# EAGLE design PowerStage (EAGLE 6.4)
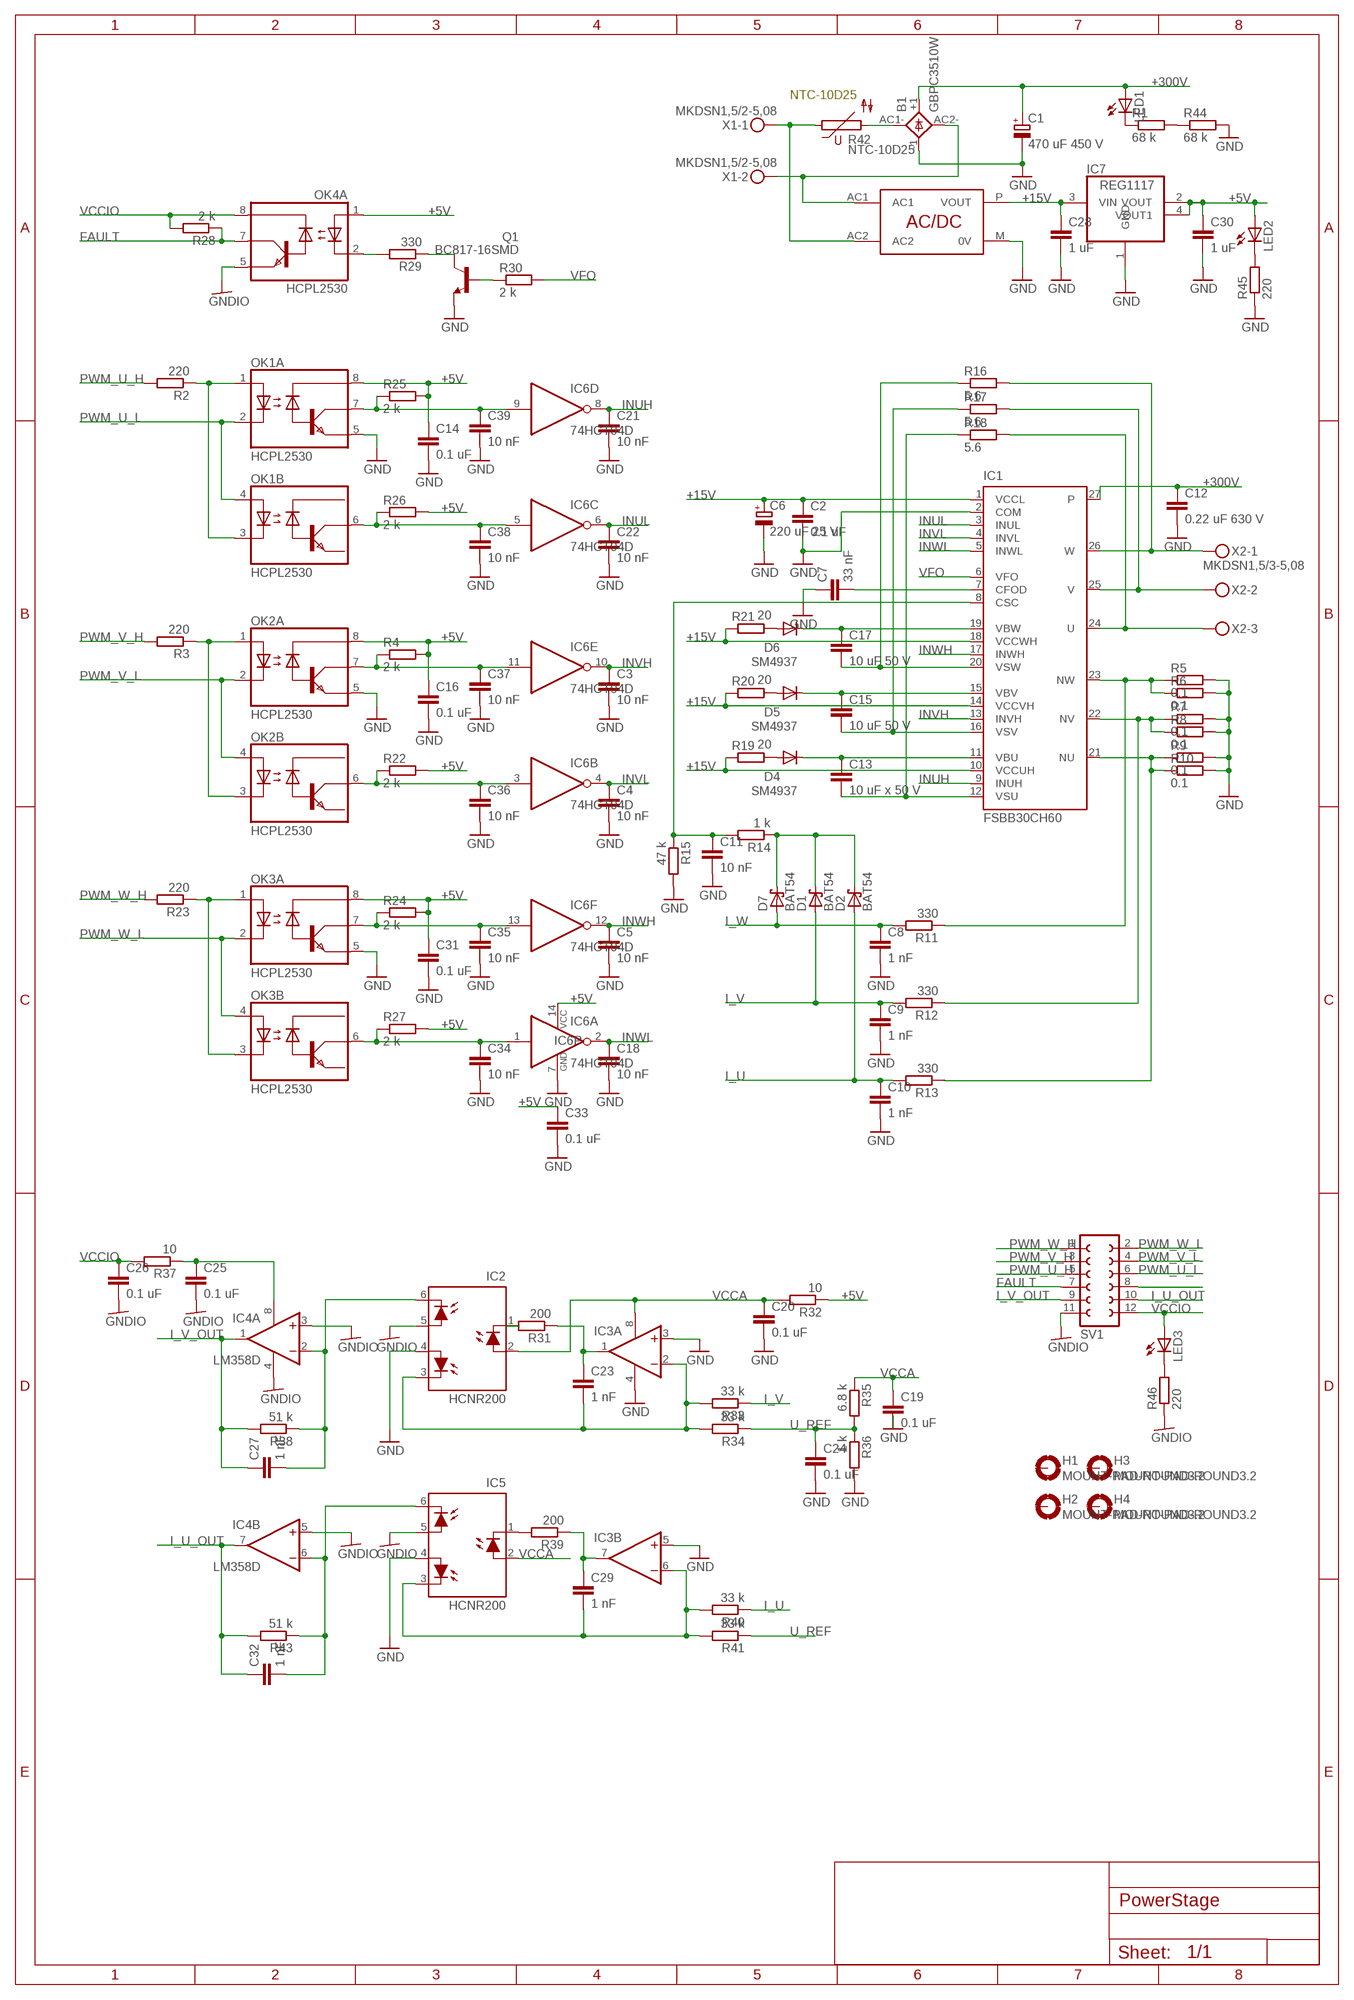
[diagram p0: schematic, sheet 1]

## Parts
B1  GBPC3510W  GBPC-W  [GBPC-W]
C1  470 uF 450 V  CPOL-EUE10-35  [EB35D]
C2  0.1 uF  C-EUC0603  [C0603]
C3  10 nF  C-EUC0603  [C0603]
C4  10 nF  C-EUC0603  [C0603]
C5  10 nF  C-EUC0603  [C0603]
C6  220 uF 25 V  CPOL-EUG  [PANASONIC_G]
C7  33 nF  C-EUC0603  [C0603]
C8  1 nF  C-EUC0603  [C0603]
C9  1 nF  C-EUC0603  [C0603]
C10  1 nF  C-EUC0603  [C0603]
C11  10 nF  C-EUC0603  [C0603]
C12  0.22 uF 630 V  C-EU150-091X182  [C150-091X182]
C13  10 uF x 50 V  C-EUC1210  [C1210]
C14  0.1 uF  C-EUC0603  [C0603]
C15  10 uF 50 V  C-EUC1210  [C1210]
C16  0.1 uF  C-EUC0603  [C0603]
C17  10 uF 50 V  C-EUC1210  [C1210]
C18  10 nF  C-EUC0603  [C0603]
C19  0.1 uF  C-EUC0603  [C0603]
C20  0.1 uF  C-EUC0603  [C0603]
C21  10 nF  C-EUC0603  [C0603]
C22  10 nF  C-EUC0603  [C0603]
C23  1 nF  C-EUC0603  [C0603]
C24  0.1 uF  C-EUC0603  [C0603]
C25  0.1 uF  C-EUC0603  [C0603]
C26  0.1 uF  C-EUC0603  [C0603]
C27  1 nF  C-EUC0603  [C0603]
C28  1 uF  C-EUC0603  [C0603]
C29  1 nF  C-EUC0603  [C0603]
C30  1 uF  C-EUC0603  [C0603]
C31  0.1 uF  C-EUC0603  [C0603]
C32  1 nF  C-EUC0603  [C0603]
C33  0.1 uF  C-EUC0603  [C0603]
C34  10 nF  C-EUC0603  [C0603]
C35  10 nF  C-EUC0603  [C0603]
C36  10 nF  C-EUC0603  [C0603]
C37  10 nF  C-EUC0603  [C0603]
C38  10 nF  C-EUC0603  [C0603]
C39  10 nF  C-EUC0603  [C0603]
D1  BAT54  [SOT23]
D2  BAT54  [SOT23]
D4  SM4937  DIODE-MELF-MLL41  [MELF-MLL41]
D5  SM4937  DIODE-MELF-MLL41  [MELF-MLL41]
D6  SM4937  DIODE-MELF-MLL41  [MELF-MLL41]
D7  BAT54  [SOT23]
H1  MOUNT-PAD-ROUND3.2  [3,2-PAD]
H2  MOUNT-PAD-ROUND3.2  [3,2-PAD]
H3  MOUNT-PAD-ROUND3.2  [3,2-PAD]
H4  MOUNT-PAD-ROUND3.2  [3,2-PAD]
IC1  FSBB30CH60  [FSBB30CH60]
IC2  HCNR200  [DIL08-400]
IC3  2AMP_P8+4D  [SO08]
IC4  LM358D  [SO08]
IC5  HCNR200  [DIL08-400]
IC6  74HCT04D  [SO14]
IC7  REG1117  [SOT223]
LED1  LEDCHIP-LED0603  [CHIP-LED0603]
LED2  LEDCHIP-LED0603  [CHIP-LED0603]
LED3  LEDCHIP-LED0603  [CHIP-LED0603]
OK1  HCPL2530  [DIL08]
OK2  HCPL2530  [DIL08]
OK3  HCPL2530  [DIL08]
OK4  HCPL2530  [DIL08]
Q1  BC817-16SMD  [SOT23-BEC]
R1  68 k  R-EU_R1206  [R1206]
R2  220  R-EU_R0603  [R0603]
R3  220  R-EU_R0603  [R0603]
R4  2 k  R-EU_R0603  [R0603]
R5  0.1  R-EU_R2512  [R2512]
R6  0.1  R-EU_R2512  [R2512]
R7  0.1  R-EU_R2512  [R2512]
R8  0.1  R-EU_R2512  [R2512]
R9  0.1  R-EU_R2512  [R2512]
R10  0.1  R-EU_R2512  [R2512]
R11  330  R-EU_R0603  [R0603]
R12  330  R-EU_R0603  [R0603]
R13  330  R-EU_R0603  [R0603]
R14  1 k  R-EU_R0603  [R0603]
R15  47 k  R-EU_R0603  [R0603]
R16  5.6  R-EU_R1206  [R1206]
R17  5.6  R-EU_R1206  [R1206]
R18  5.6  R-EU_R1206  [R1206]
R19  20  R-EU_R1206  [R1206]
R20  20  R-EU_R1206  [R1206]
R21  20  R-EU_R1206  [R1206]
R22  2 k  R-EU_R0603  [R0603]
R23  220  R-EU_R0603  [R0603]
R24  2 k  R-EU_R0603  [R0603]
R25  2 k  R-EU_R0603  [R0603]
R26  2 k  R-EU_R0603  [R0603]
R27  2 k  R-EU_R0603  [R0603]
R28  2 k  R-EU_R0603  [R0603]
R29  330  R-EU_R0603  [R0603]
R30  2 k  R-EU_R0603  [R0603]
R31  200  R-EU_R0603  [R0603]
R32  10  R-EU_R0603  [R0603]
R33  33 k  R-EU_R0603  [R0603]
R34  33 k  R-EU_R0603  [R0603]
R35  6.8 k  R-EU_R0603  [R0603]
R36  1 k  R-EU_R0603  [R0603]
R37  10  R-EU_R0603  [R0603]
R38  51 k  R-EU_R0603  [R0603]
R39  200  R-EU_R0603  [R0603]
R40  33 k  R-EU_R0603  [R0603]
R41  33 k  R-EU_R0603  [R0603]
R42  NTC-10D25  S20K40  [S20K40]
R43  51 k  R-EU_R0603  [R0603]
R44  68 k  R-EU_R1206  [R1206]
R45  220  R-EU_R0603  [R0603]
R46  220  R-EU_R0603  [R0603]
SV1  FE06-2  [FE06-2]
U$1  KUUKO_090873  [KUUKO_090873]
X1  MKDSN1,5/2-5,08  [MKDSN1,5/2-5,08]
X2  MKDSN1,5/3-5,08  [MKDSN1,5/3-5,08]

## Nets
+5V: C14.1 C16.1 C30.1 C31.1 C33.1 IC6.14(P:VCC) IC7.2(VOUT) IC7.4(VOUT1) LED2.A OK1.8(A:VCC) OK2.8(A:VCC) OK3.8(A:VCC) OK4.1(A:A1) R4.2 R22.2 R24.2 R25.2 R26.2 R27.2 R32.1
+15V: C2.1 C6.+ C28.1 IC1.1(VCCL) IC1.10(VCCUH) IC1.14(VCCVH) IC1.18(VCCWH) IC7.3(VIN) R19.1 R20.1 R21.1 U$1.P(VOUT)
+300V: B1.+1(+) C1.+ C12.1 IC1.27(P) LED1.A
FAULT: OK4.7(A:VO1) R28.1 SV1.7
GND: B1.-1(-) C1.- C2.2 C3.2 C4.2 C5.2 C6.- C7.1 C8.2 C9.2 C10.2 C11.2 C12.2 C14.2 C16.2 C18.2 C19.2 C20.2 C21.2 C22.2 C24.2 C28.2 C30.2 C31.2 C33.2 C34.2 C35.2 C36.2 C37.2 C38.2 C39.2 IC1.2(COM) IC2.4(A1) IC3.3(A:+IN) IC3.4(P:V-) IC3.5(B:+IN) IC5.4(A1) IC6.7(P:GND) IC7.1(GND) OK1.5(A:GND) OK2.5(A:GND) OK3.5(A:GND) Q1.E R5.2 R6.2 R7.2 R8.2 R9.2 R10.2 R15.2 R36.2 R44.2 R45.1 U$1.M(0V)
GNDIO: C25.2 C26.2 IC2.5(A2) IC4.3(A:+IN) IC4.4(P:V-) IC4.5(B:+IN) IC5.5(A2) OK4.5(A:GND) R46.1 SV1.11
I_U: C10.1 D2.1(A) R13.2 R40.1
I_U_OUT: C32.1 IC4.7(B:OUT) R43.2 SV1.10
I_V: C9.1 D1.1(A) R12.2 R33.1
I_V_OUT: C27.1 IC4.1(A:OUT) R38.2 SV1.9
I_W: C8.1 D7.1(A) R11.2
INUH: C21.1 IC1.9(INUH) IC6.8(D:O)
INUL: C22.1 IC1.3(INUL) IC6.6(C:O)
INVH: C3.1 IC1.13(INVH) IC6.10(E:O)
INVL: C4.1 IC1.4(INVL) IC6.4(B:O)
INWH: C5.1 IC1.17(INWH) IC6.12(F:O)
INWL: C18.1 IC1.5(INWL) IC6.2(A:O)
N$1: IC1.23(NW) R5.1 R6.1 R11.1
N$2: OK1.1(A:A1) OK1.3(B:C2) R2.1
N$3: B1.AC1-(AC1) R42.2
N$5: B1.AC2-(AC2) U$1.AC1 X1.2
N$6: IC1.26(W) R16.2 X2.1
N$7: IC1.25(V) R17.2 X2.2
N$8: IC1.24(U) R18.2 X2.3
N$9: IC5.1(C) R39.2
N$10: C25.1 IC4.8(P:V+) R37.1
N$11: IC1.22(NV) R7.1 R8.1 R12.1
N$12: IC1.21(NU) R9.1 R10.1 R13.1
N$13: C7.2 IC1.7(CFOD)
N$14: D1.3(C) D2.3(C) D7.3(C) R14.1
N$15: C11.1 IC1.8(CSC) R14.2 R15.1
N$16: C13.1 D4.C IC1.11(VBU)
N$17: C13.2 IC1.12(VSU) R18.1
N$18: D4.A R19.2
N$19: C15.1 D5.C IC1.15(VBV)
N$20: C15.2 IC1.16(VSV) R17.1
N$21: D5.A R20.2
N$22: C17.1 D6.C IC1.19(VBW)
N$23: C17.2 IC1.20(VSW) R16.1
N$24: D6.A R21.2
N$25: OK4.2(A:C1) R29.2
N$26: Q1.C R29.1
N$27: Q1.B R30.1
N$28: C23.2 IC2.3(C1) IC3.2(A:-IN) R33.2 R34.2
N$29: OK2.1(A:A1) OK2.3(B:C2) R3.1
N$30: SV1.8
N$31: C27.2 IC2.6(C2) IC4.2(A:-IN) R38.1
N$32: OK3.1(A:A1) OK3.3(B:C2) R23.1
N$33: C39.1 IC6.9(D:I) OK1.7(A:VO1) R25.1
N$34: C29.2 IC3.6(B:-IN) IC5.3(C1) R40.2 R41.2
N$35: C29.1 IC3.7(B:OUT) R39.1
N$36: C23.1 IC3.1(A:OUT) R31.1
N$37: C32.2 IC4.6(B:-IN) IC5.6(C2) R43.1
N$38: IC2.1(C) R31.2
N$39: C38.1 IC6.5(C:I) OK1.6(B:VO2) R26.1
N$40: C37.1 IC6.11(E:I) OK2.7(A:VO1) R4.1
N$41: C36.1 IC6.3(B:I) OK2.6(B:VO2) R22.1
N$42: C35.1 IC6.13(F:I) OK3.7(A:VO1) R24.1
N$43: C34.1 IC6.1(A:I) OK3.6(B:VO2) R27.1
N$44: LED1.C R1.1
N$45: R1.2 R44.1
N$46: LED2.C R45.2
N$47: LED3.C R46.2
N$48: R42.1 U$1.AC2 X1.1
PWM_U_H: R2.2 SV1.5
PWM_U_L: OK1.2(A:C1) OK1.4(B:A2) SV1.6
PWM_V_H: R3.2 SV1.3
PWM_V_L: OK2.2(A:C1) OK2.4(B:A2) SV1.4
PWM_W_H: R23.2 SV1.1
PWM_W_L: OK3.2(A:C1) OK3.4(B:A2) SV1.2
U_REF: C24.1 R34.1 R35.2 R36.1 R41.1
VCCA: C19.1 C20.1 IC2.2(A) IC3.8(P:V+) IC5.2(A) R32.2 R35.1
VCCIO: C26.1 LED3.A OK4.8(A:VCC) R28.2 R37.2 SV1.12
VFO: IC1.6(VFO) R30.2
Unconnected: H1.B3,2(MOUNT) H2.B3,2(MOUNT) H3.B3,2(MOUNT) H4.B3,2(MOUNT) OK4.3(B:C2) OK4.4(B:A2) OK4.6(B:VO2)

## Notes on the sheet
- NTC-10D25

## Library data of the parts
B1 = rectifier:GBPC-W
C1 C6 = rcl:CPOL-EU: POLARIZED CAPACITOR, European symbol
C2-C5 C7-C39 = rcl:C-EU: CAPACITOR, European symbol
D1 D2 D7 = diode:BAT54: Schottky Diodes Source: Fairchild .. BAT54.pdf
D4-D6 = diode:DIODE-: DIODE
H1-H4 = holes:MOUNT-PAD-ROUND: MOUNTING PAD, round
IC1 = fairchild-semic:FSBB30CH60: Smart Power Module 600V-30A IGBT inverter for three-phase DC/AC power conversion Source: http://www.fairchildsemi.com/ds/FS/FSBB30CH60.pdf; MPN: FSBB30CH60B; OC_FARNELL: 1783234; OC_NEWARK: 78M1076
IC2 IC5 = avago:HCNR20*: High-Linearity Analog Optocouplers Source: AV02-0886EN+DS+HCNR200+10Dec2011.pdf
IC3 = linear:2AMP_P8+4: OP AMP
IC4 = linear:LM358: OP AMP also LM158; LM258; LM2904 Source: http://cache.national.com/ds/LM/LM158.pdf
IC6 = 74xx-eu:74*04: Hex INVERTER
IC7 = burr-brown:REG1117: 800mA and 1A Low Dropout (LDO) Positive Regulator 1.8V, 2.5V, 2.85V, 3.3V, 5V, and Adj; MPN: REG1117; OC_FARNELL: 1097566; OC_NEWARK: 14P6981
LED1-LED3 = led:LED: LED OSRAM: - CHIPLED LG R971, LG N971, LY N971, LG Q971, LY Q971, LO R971, LY R971 LH N974, LH R974 LS Q976, LO Q976, LY Q976 LO Q996 - Hyper CHIPLED LW Q18S LB Q993, LB Q99A, LB R99A - SideLED LS A670, LO A670, LY A670, LG A670, LP A670 LB A673, LV A673, LT A673, LW A673 LH A674 LY A675 LS A676, LA A676, LO A676, LY A676, LW A676 LS A679, LY A679, LG A679 - Hyper Micro SIDELED® LS Y876, LA Y876, LO Y876, LY Y876 LT Y87S - SmartLED LW L88C, LW L88S LB L89C, LB L89S, LG L890 LS L89K, LO L89K, LY L89K LS L896, LA L896, LO L896, LY L896 - TOPLED LS T670, LO T670, LY T670, LG T670, LP T670 LSG T670, LSP T670, LSY T670, LOP T670, LYG T670 LG T671, LOG T671, LSG T671 LB T673, LV T673, LT T673, LW T673 LH T674 LS T676, LA T676, LO T676, LY T676, LB T676, LH T676, LSB T676, LW T676 LB T67C, LV T67C, LT T67C, LS T67K, LO T67K, LY T67K, LW E67C LS E67B, LA E67B, LO E67B, LY E67B, LB E67C, LV E67C, LT E67C LW T67C LS T679, LY T679, LG T679 LS T770, LO T770, LY T770, LG T770, LP T770 LB T773, LV T773, LT T773, LW T773 LH T774 LS E675, LA E675, LY E675, LS T675 LS T776, LA T776, LO T776, LY T776, LB T776 LHGB T686 LT T68C, LB T68C - Hyper Mini TOPLED® LB M676 - Mini TOPLED Santana® LG M470 LS M47K, LO M47K, LY M47K Source: http://www.osram.convergy.de LUXEON: - LUMILED® LXK2-PW12-R00, LXK2-PW12-S00, LXK2-PW14-U00, LXK2-PW14-V00 LXK2-PM12-R00, LXK2-PM12-S00, LXK2-PM14-U00 LXK2-PE12-Q00, LXK2-PE12-R00, LXK2-PE12-S00, LXK2-PE14-T00, LXK2-PE14-U00 LXK2-PB12-K00, LXK2-PB12-L00, LXK2-PB12-M00, LXK2-PB14-N00, LXK2-PB14-P00, LXK2-PB14-Q00 LXK2-PR12-L00, LXK2-PR12-M00, LXK2-PR14-Q00, LXK2-PR14-R00 LXK2-PD12-Q00, LXK2-PD12-R00, LXK2-PD12-S00 LXK2-PH12-R00, LXK2-PH12-S00 LXK2-PL12-P00, LXK2-PL12-Q00, LXK2-PL12-R00 Source: www.luxeon.com KINGBRIGHT: KA-3528ASYC Source: www.kingbright.com
OK1-OK4 = optocoupler:HCPL2530: HEWLETT PACKARD OPTO COUPLER; MF: AGILENT TECHNOLOGIES; MPN: HCPL-2530-000E; OC_FARNELL: 9994793; OC_NEWARK: 31K6974
Q1 = transistor-npn:BC817*: NPN Transistor
R1 R44 = resistor:R-EU_: RESISTOR, European symbol
R2-R41 R43 R45 R46 = rcl:R-EU_: RESISTOR, European symbol
R42 = varistor:S20K40: VARISTOR
SV1 = con-lsta:FE06-2: FEMALE HEADER; OC_FARNELL: unknown; OC_NEWARK: unknown
U$1 = dc-dc-converter:KUUKO_090873
X1 = con-phoenix-508:MKDSN1,5/2-5,08: MKDSN 1,5/ 2-5,08 Printklemme Nennstrom: 13,5 A Nennspannung: 250 V Rastermaß: 5,08 mm Polzahl: 2 Anschlussart: Schraubanschluss Montage: Löten Anschlussrichtung Leiter/Platine: 0 ° Artikelnummer: 1729128 Source: http://eshop.phoenixcontact.com .. 1729128.pdf; MPN: MKDSN 1,5/2-5.08; OC_FARNELL: 1792903; OC_NEWARK: 30M2397
X2 = con-phoenix-508:MKDSN1,5/3-5,08: MKDSN 1,5/ 3-5,08 Printklemme Nennstrom: 13,5 A Nennspannung: 250 V Rastermaß: 5,08 mm Polzahl: 3 Anschlussart: Schraubanschluss Montage: Löten Anschlussrichtung Leiter/Platine: 0 ° Artikelnummer: 1729131 Source: http://eshop.phoenixcontact.com .. 1729131.pdf; MPN: SMKDSN1,5/3-5,08; OC_FARNELL: 1792904; OC_NEWARK: 70R0299

## Board
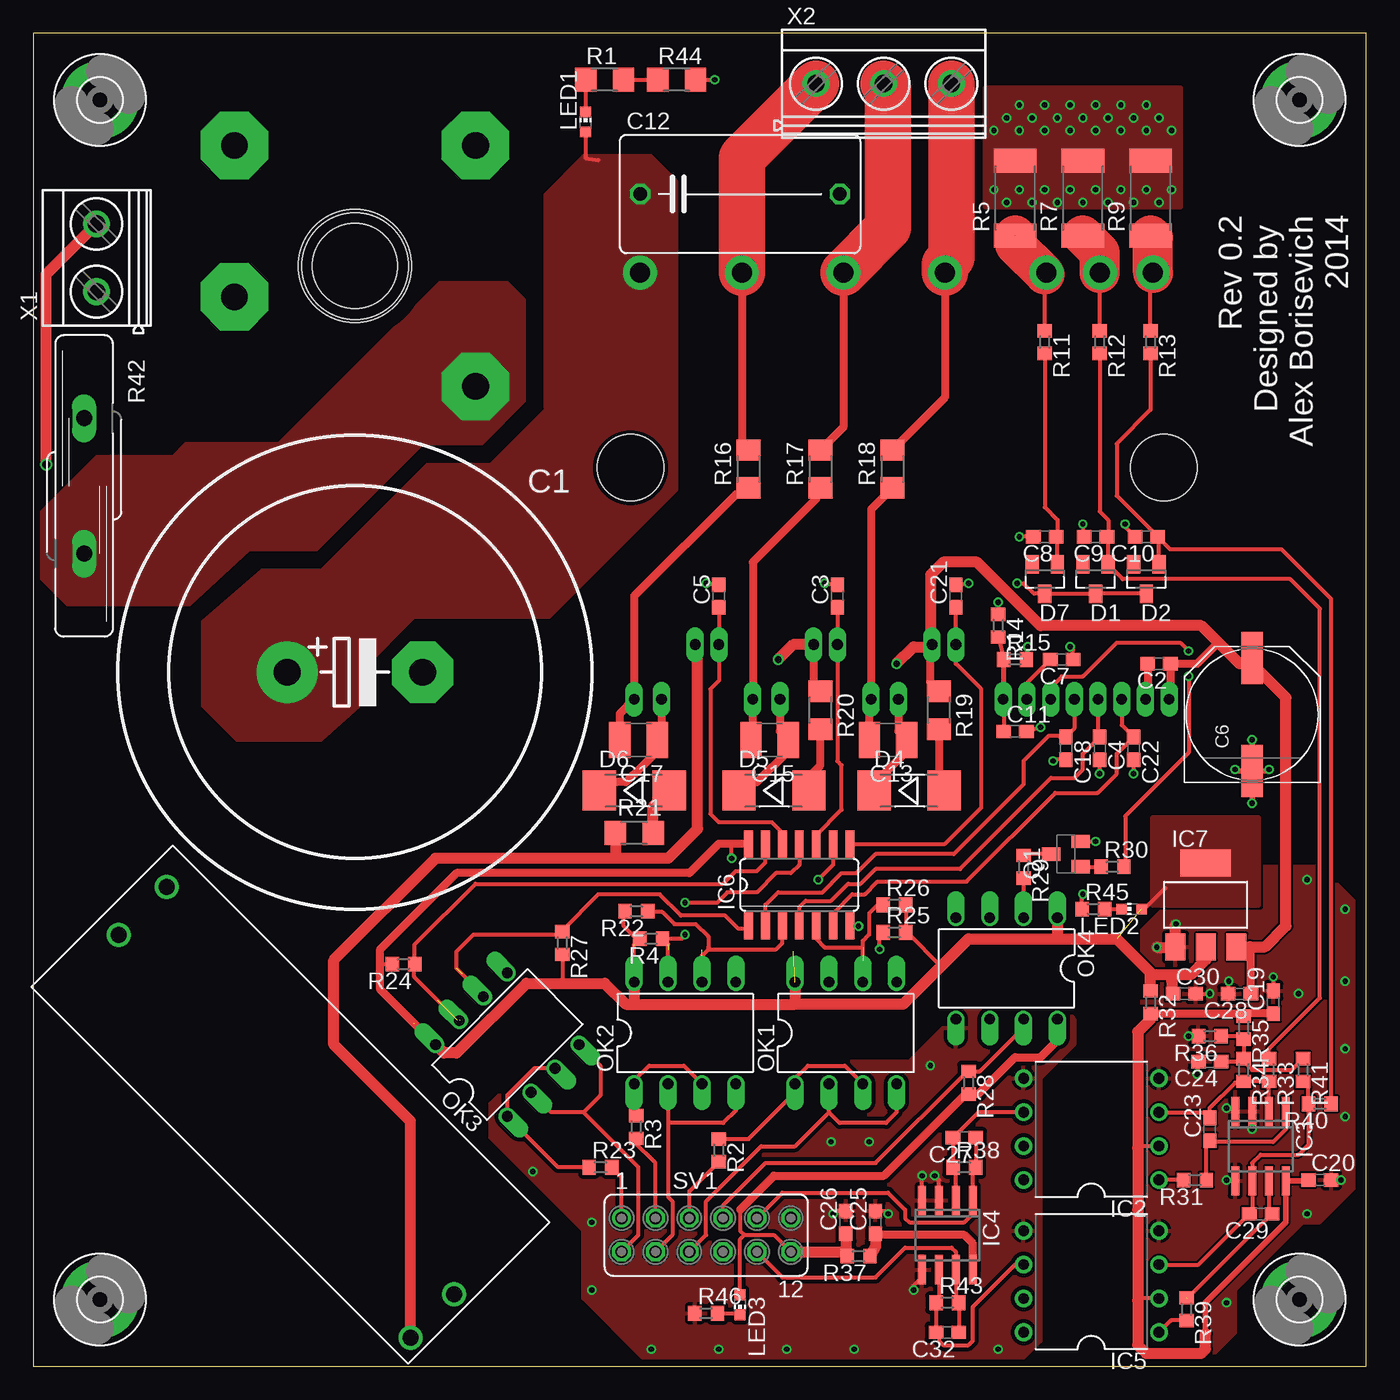
[diagram p1: board, top side]
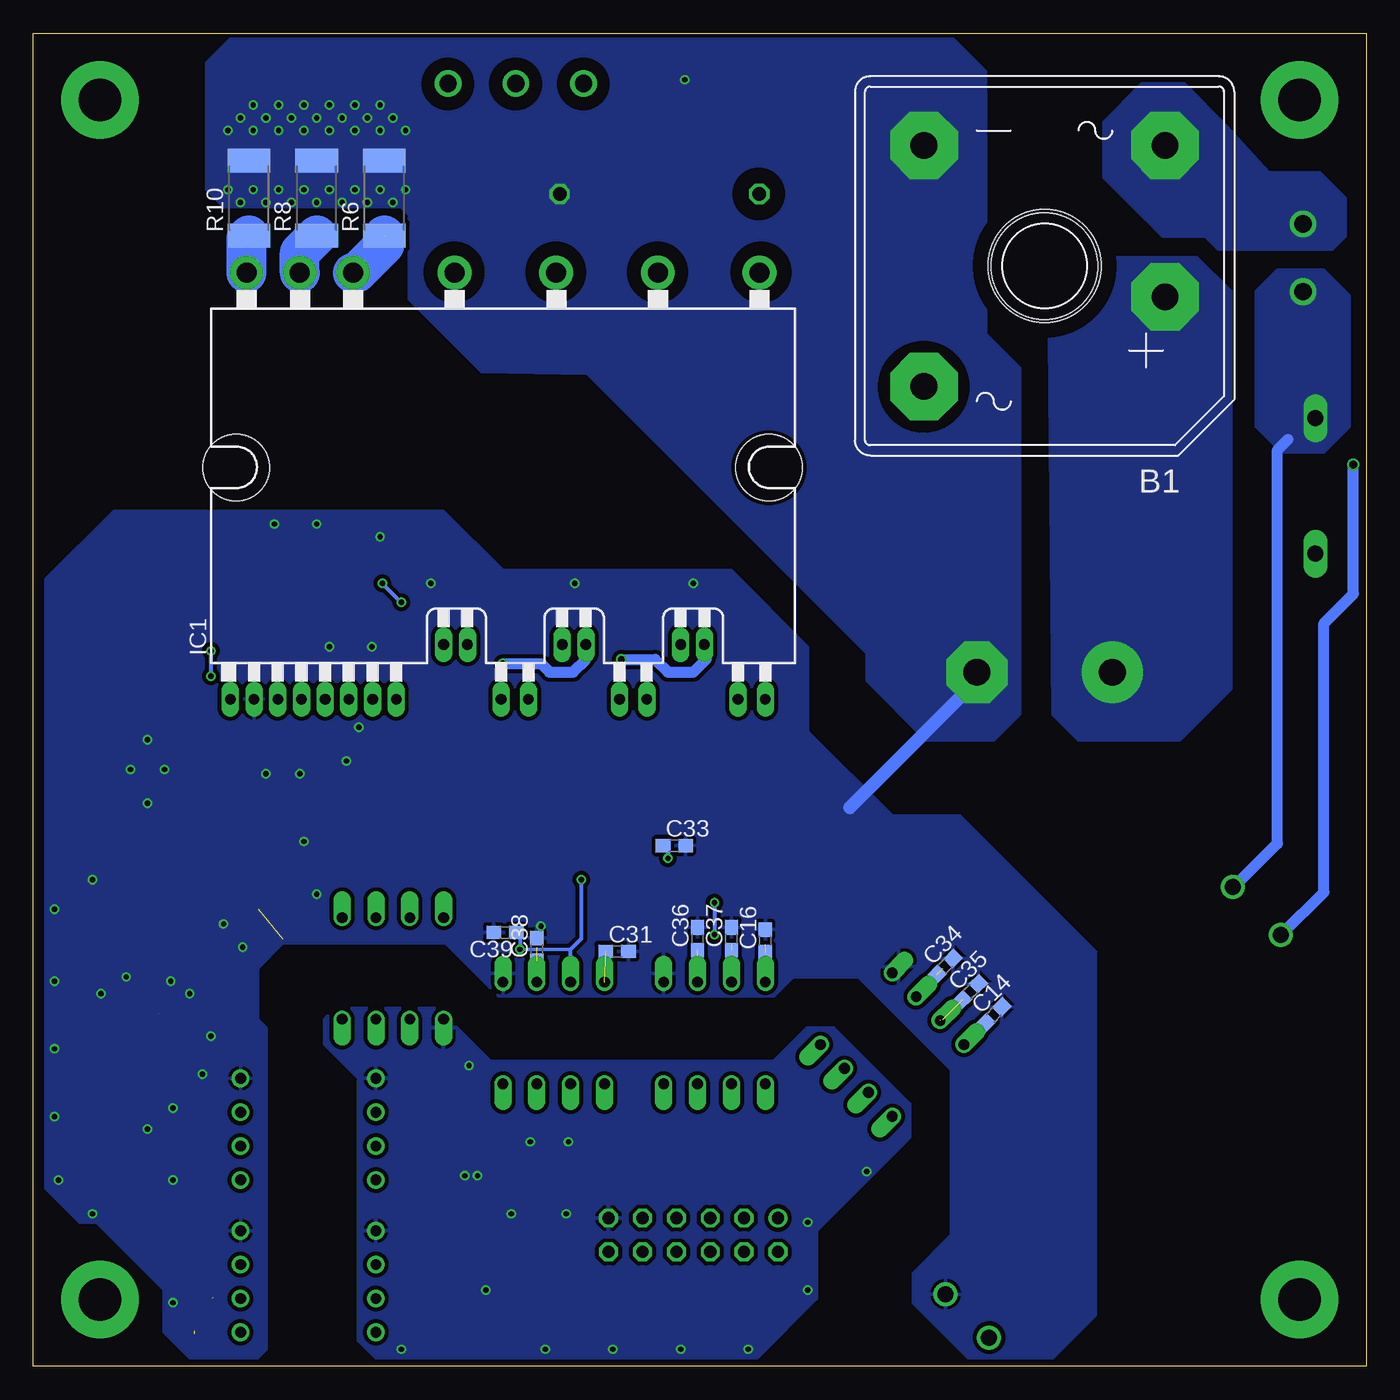
[diagram p2: board, bottom side, seen from below]

Size 100 x 100 mm. Coordinates in mm from the lower left corner, seen from the top.
Outline: 0,0 100,0 100,100 0,100 0,0
Copper layers (1*16): Top 0.035mm / dielectric 1.5mm / Bottom 0.035mm
Design rules "ITEADstudio_DRC": minimum track width 6mil, minimum drill 12mil, track to track 6mil, track to pad 6mil, pad to pad 6mil, via to via 6mil, smd to smd 0mil, copper to edge 10mil, drill to drill 10mil, minimum pad ring 10mil, minimum via ring 6mil, stop-mask expansion 2mil, vias tented up to drill 100mil, thermal gap 10mil
Holes 5 mm at 84.8,67.4 44.8,67.4
Holes 8 mm at 24.13,82.55
Holes 8.5 mm at 24.13,82.55
bRestrict: area 30.2,70.5 to 36.2,76.5; area 44.1,86.5 to 47,89.4; area 57.3,94.7 to 60.2,97.7; area 62.4,94.7 to 65.3,97.7; area 67.4,94.7 to 70.4,97.7; area 43.6,80.3 to 47.2,83.8; area 51.4,80.3 to 55,83.8; area 59,80.3 to 62.6,83.8; area 66.6,80.3 to 70.2,83.8

### Footprints (pad centres in the part's own frame; a part is rotated, then mirrored left to right if it is on the bottom)
GBPC-W = drill 2.007 pad 5.08 octagon: +1 -9.042,2.32; -1 9.042,-9.042; AC1- 9.042,9.042; AC2- -9.042,-9.042 | hole 6.401: 0,0
EB35D = drill 2.007 pad 4.597: + -5.08,0 | drill 2.007 pad 4.597 octagon: - 5.08,0
C0603 = smd 1.1 x 1: 1 -0.85,0; 2 0.85,0
PANASONIC_G = smd 3.9 x 1.6: + 4.25,0; - -4.25,0
C150-091X182 = drill 1.016 octagon: 1 -7.493,0; 2 7.493,0
C1210 = smd 1.6 x 2.7: 1 -1.4,0; 2 1.4,0
SOT23 = smd 1 x 1.4: 1 -0.95,-1.1; 2 0.95,-1.1; 3 0,1.1
MELF-MLL41 = smd 2.5 x 3: A 2.625,0; C -2.625,0
3,2-PAD = drill 3.2 pad 5.842: B3,2 0,0
FSBB30CH60 = drill 0.8 pad 1.27 long: 1 -20.447,-16; 2 -18.669,-16; 3 -16.891,-16; 4 -15.113,-16; 5 -13.335,-16; 6 -11.557,-16; 7 -9.779,-16; 8 -8.001,-16; 9 -4.445,-11.9; 10 -2.667,-11.9; 11 -0.136,-16; 12 1.914,-16; 13 4.445,-11.9; 14 6.223,-11.9; 15 8.754,-16; 16 10.804,-16; 17 13.335,-11.9; 18 15.113,-11.9; 19 17.644,-16; 20 19.694,-16 | drill 1.5 pad 2.54: 21 -19.24,16; 22 -15.24,16; 23 -11.24,16; 24 -3.62,16; 25 4,16; 26 11.62,16; 27 19.24,16
DIL08-400 = drill 0.813 pad 1.3: 1 -3.81,-5.08; 2 -1.27,-5.08; 3 1.27,-5.08; 4 3.81,-5.08; 5 3.81,5.08; 6 1.27,5.08; 7 -1.27,5.08; 8 -3.81,5.08
SO08 = smd 0.6 x 2.2: 1 -1.905,-2.6; 2 -0.635,-2.6; 3 0.635,-2.6; 4 1.905,-2.6; 5 1.905,2.6; 6 0.635,2.6; 7 -0.635,2.6; 8 -1.905,2.6
SO14 = smd 0.66 x 2.032: 1 -3.81,-3.073; 2 -2.54,-3.073; 3 -1.27,-3.073; 4 0,-3.073; 5 1.27,-3.073; 6 2.54,-3.073; 7 3.81,-3.073; 8 3.81,3.073; 9 2.54,3.073; 10 1.27,3.073; 11 0,3.073; 12 -1.27,3.073; 13 -2.54,3.073; 14 -3.81,3.073
SOT223 = smd 1.499 x 2.007: 1 -2.261,-3.15; 2 0.025,-3.15; 3 2.311,-3.15 | smd 3.81 x 2.007: 4 0,3.15
CHIP-LED0603 = smd 0.8 x 0.8: A 0,-0.75; C 0,0.75
DIL08 = drill 0.813 offset: 1 -3.81,-3.81; 2 -1.27,-3.81; 3 1.27,-3.81; 4 3.81,-3.81; 5 3.81,3.81; 6 1.27,3.81; 7 -1.27,3.81; 8 -3.81,3.81
SOT23-BEC = smd 1 x 1.4: B -0.95,-1.1; C 0,1.1; E 0.95,-1.1
R1206 = smd 1.6 x 1.803: 1 -1.422,0; 2 1.422,0
R0603 = smd 1 x 1.1: 1 -0.85,0; 2 0.85,0
R2512 = smd 1.8 x 3.2: 1 -2.8,0; 2 2.8,0
S20K40 = drill 1.194 long: 1 0,-5.08; 2 0,5.08
FE06-2 = drill 0.914: 1 -6.35,1.27 | drill 0.914 octagon: 2 -6.35,-1.27; 3 -3.81,1.27; 4 -3.81,-1.27; 5 -1.27,1.27; 6 -1.27,-1.27; 7 1.27,1.27; 8 1.27,-1.27; 9 3.81,1.27; 10 3.81,-1.27; 11 6.35,1.27; 12 6.35,-1.27
KUUKO_090873 = drill 1.2: AC1 38.1,7.62; AC2 38.1,2.54; M 1.27,8.89; P 1.27,13.5
MKDSN1,5/2-5,08 = drill 1.3 pad 2: 1 -2.561,0.025; 2 2.519,0.025
MKDSN1,5/3-5,08 = drill 1.3 pad 2: 1 -7.641,0.025; 2 -2.561,0.025; 3 2.519,0.025

### Placement (x,y rotation side)
B1  24.13,82.55 180 bottom
C1  24.13,52.07 0 top
C2  84.45,52.7 180 top
C3  60.33,57.78 90 top
C4  80.01,46.35 270 top
C5  51.44,57.78 90 top
C6  91.44,48.9 90 top
C7  77.15,53.02 180 top
C8  75.88,62.23 180 top
C9  79.69,62.23 180 top
C10  83.5,62.23 180 top
C11  73.66,47.62 0 top
C12  53.02,87.95 0 top
C13  64.14,46.99 180 top
C14  27.94,26.35 45 bottom
C15  55.24,46.99 180 top
C16  45.09,31.91 90 bottom
C17  45.4,46.99 180 top
C18  77.47,46.35 270 top
C19  93.03,27.3 90 top
C20  96.52,13.97 0 top
C21  69.22,57.78 90 top
C22  82.55,46.35 270 top
C23  88.27,17.78 90 top
C24  88.27,22.86 180 top
C25  63.18,10.79 90 top
C26  60.96,10.79 90 top
C27  69.85,17.14 180 top
C28  90.49,27.94 180 top
C29  92.08,11.43 180 top
C30  86.36,27.94 0 top
C31  56.2,31.11 0 bottom
C32  68.58,2.54 180 top
C33  51.91,39.05 0 bottom
C34  31.59,30 45 bottom
C35  29.69,28.1 45 bottom
C36  50.16,32.07 90 bottom
C37  47.62,32.07 90 bottom
C38  62.23,31.27 90 bottom
C39  64.61,32.54 180 bottom
D1  79.69,59.05 180 top
D2  83.5,59.05 180 top
D4  65.72,43.18 0 top
D5  55.56,43.18 0 top
D6  45.09,43.18 0 top
D7  75.88,59.05 180 top
H1  5,95 0 top
H2  5,5 0 top
H3  95,5 0 top
H4  95,95 0 top
IC1  64.77,66.04 0 bottom
IC2  79.38,17.78 90 top
IC3  92.08,16.51 180 top
IC4  68.58,9.84 180 top
IC5  79.38,6.35 90 top
IC6  57.47,36.12 0 top
IC7  87.95,34.61 0 top
LED1  41.43,93.34 0 top
LED2  82.39,34.29 90 top
LED3  53.02,4.6 180 top
OK1  60.96,25 0 top
OK2  48.9,25 0 top
OK3  35.56,24.13 45 top
OK4  73.03,29.84 180 top
Q1  77.47,38.42 90 top
R1  42.86,96.52 0 top
R2  51.44,16.19 270 top
R3  45.24,17.94 270 top
R4  46.35,32.07 180 top
R5  73.66,87.63 90 top
R6  73.66,87.63 90 bottom
R7  78.74,87.63 90 top
R8  78.74,87.63 90 bottom
R9  83.82,87.63 90 top
R10  83.82,87.63 90 bottom
R11  75.88,76.83 270 top
R12  80.01,76.83 270 top
R13  83.82,76.83 270 top
R14  72.39,55.56 270 top
R15  73.66,53.02 0 top
R16  53.66,67.31 90 top
R17  59.05,67.31 90 top
R18  64.45,67.31 90 top
R19  67.94,49.21 270 top
R20  59.05,49.21 270 top
R21  45.09,40.01 0 top
R22  45.24,34.13 180 top
R23  42.55,14.92 0 top
R24  27.78,30.16 180 top
R25  64.61,32.54 0 top
R26  64.61,34.61 0 top
R27  39.69,31.75 270 top
R28  70.17,21.27 270 top
R29  74.3,37.47 270 top
R30  80.96,37.47 0 top
R31  87.15,13.97 180 top
R32  83.82,27.3 270 top
R33  92.71,22.23 270 top
R34  90.81,22.23 270 top
R35  90.81,25.4 270 top
R36  88.27,24.77 180 top
R37  61.91,8.26 180 top
R38  69.85,14.92 0 top
R39  86.52,4.29 270 top
R40  96.52,19.68 180 top
R41  95.25,22.23 270 top
R42  3.81,66.04 180 top
R43  68.58,4.76 0 top
R44  48.26,96.52 0 top
R45  79.53,34.29 0 top
R46  50.48,3.97 0 top
SV1  50.48,9.84 0 top
U$1  38.73,10.79 135 top
X1  4.76,83.19 90 top
X2  66.36,96.2 0 top

### Tracks (layer width: path | path; a pad name or v marks a point on that pad's centre or on a via)
+5V  (via drill 0.4)  (4 unrouted)
  Top 0.305: R27.2 39.69,28.73 | IC7.2 87.97,30.5 | 85.41,28.89 85.41,29.37 | R26.2 R25.2 65.56,32.54 68.1,30 | OK2.8 45.09,31.65 R4.2 45.24,32.07 44.29,33.02 44.29,34.03 R22.2 | R24.2 26.04,30.16 | v52.39,38.1 52.39,39.19 | 83.19,34.29 LED2.A 83.34,34.29 84.93,35.88
  Top 0.61: IC6.14 52.39,39.19 51.41,39.19 49.21,36.99 31.75,36.99 26.04,31.27 26.04,30.16 26.04,28.26 27.3,26.99 28.58,25.72 OK3.8
  Top 0.813: 85.41,28.89 85.41,28.04 C30.1 | OK3.8 30.81,23.5 31.75,23.5 36.99,28.73 39.69,28.73 42.86,28.73 44.45,27.15 45.09,27.15 | OK2.8 45.09,27.15 | OK1.8 57.15,27.15 | R32.1 83.82,29.37 | 83.82,29.37 83.82,29.53 81.28,32.07 76.83,32.07 | 76.83,32.07 70.17,32.07 68.1,30 65.25,27.15 57.15,27.15 | OK4.1 76.83,32.07 | 45.09,27.15 57.15,27.15 | 87.97,30.5 86.84,29.37 85.41,29.37 83.82,29.37
  Bottom 0.305: v52.39,38.1 52.39,39.05 C33.1
  pour Top (isolate 0.406, no thermals): 83.98,41.12 83.98,34.61 91.92,34.61 91.92,41.12
+15V  (via drill 0.5)
  Top 0.305: 91.34,31.4 91.28,31.46
  Top 0.61: IC1.14 58.55,51.14 R20.1 | IC1.1 85.31,50.13 C2.1 87.31,52.7 88.9,54.29 | 91,52.7 91.06,52.77 C6.+ | 67.27,53.98 67.27,51.31 R19.1 | C28.1 91.34,31.4
  Top 0.813: IC1.14 57,54.14 v55.88,53.02 | IC1.18 49.85,53.95 49.85,40.32 47.62,38.1 43.81,38.1 | R21.1 43.66,38.25 43.81,38.1 | 43.81,38.1 30.16,38.1 22.54,30.48 22.54,24.13 28.29,18.38 U$1.P | 91.06,52.77 91.44,52.39 91.76,52.39 93.98,50.16 93.98,33.02 92.42,31.46 91.28,31.46 IC7.3 | 91,52.7 90.49,52.7 88.9,54.29 87.63,55.56 75.56,55.56 70.8,60.33 68.26,60.33 67.31,59.37 67.31,54.27 IC1.10 67.27,53.98 66.04,53.98 v64.77,52.7
  Bottom 0.813: v55.88,53.02 53.34,53.02 52.39,52.07 50.48,52.07 49.53,53.02 49.53,53.95 IC1.18 | v64.77,52.7 61.91,52.7 61.28,52.07 59.5,52.07 58.55,53.02 IC1.14
+300V
  Top 0.305: LED1.A 41.43,90.65 42.39,90.49
  pour Bottom (isolate 0.305, no thermals): 10.16,80.64 12.7,83.19 21.91,83.19 23.81,81.28 23.5,48.9 21.59,46.99 13.97,46.99 10.16,50.8
  pour Top (isolate 0.305, no thermals): 15.24,46.99 21.59,46.99 24.77,49.85 24.77,52.39 28.57,56.2 38.73,56.2 48.26,65.72 48.26,88.9 46.35,90.81 41.27,90.81 38.42,87.95 38.42,71.75 34.29,67.63 29.53,67.63 21.59,59.69 17.14,59.69 12.7,55.88 12.7,49.53
FAULT
  Top 0.305: OK4.7 74.3,25.3 74.08,25.08 73.98,25.08 71.02,22.12 R28.1 69.85,21.91 63.18,15.24 54.93,15.24 51.75,12.06 SV1.7
GND  (via drill 0.4)
  Top 0.305: IC3.5 89.59,13.91 v89.53,13.97 | v89.53,19.37 90.17,19.37 IC3.4 | IC3.3 v91.44,17.78 | C20.2 v98.11,13.97 | R36.2 v86.68,24.77 | v87.31,21.91 87.31,22.86 C24.2 | C30.2 v88.27,27.94 | v93.03,29.21 C19.2 | v89.69,28.89 89.69,28.1 C28.2 | C5.2 50.59,58.63 v50.48,58.74 | C3.2 59.48,58.63 v59.37,58.74 | C21.2 69.32,58.63 v70.17,58.74 | R15.2 v74.61,53.98 | C11.2 v75.56,47.94 | C8.2 v73.98,62.23 | v78.74,63.18 78.74,62.33 C9.2 | v81.92,63.18 81.92,62.97 C10.2 | C7.1 78,53.76 v77.79,53.98 | C18.2 76.62,45.51 v76.52,45.4 | v80.01,44.45 C4.2 | v82.55,44.45 C22.2 | Q1.E v79.69,39.37 | 85.69,33.14 v85.72,33.18 | 85.66,31.43 IC7.1 | 64.77,30 OK1.5 | IC6.7 61.78,33.04 v61.91,33.02 | R44.2 v51.12,96.52 | R45.1 78.68,35.34 v78.74,35.4
  Top 0.406: C6.- 90.29,44.65 v90.17,44.77 | C6.- v91.44,46.99 | C6.- 92.59,44.65 v92.71,44.77 | C6.- v91.44,42.23
  Top 0.61: C2.2 83.61,50.21 IC1.2
  Top 0.813: IC7.1 85.69,33.14 | v84.3,31.43 85.66,31.43
  Bottom 1.016: C1.- 29.21,51.44 38.73,41.91
  other vias: 72.07,88.27 73.98,88.27 75.88,88.27 74.93,87.31 78.74,87.31 79.69,88.27 80.64,87.31 81.6,88.27 82.55,87.31 83.5,88.27 73.03,87.31 76.83,87.31 77.79,88.27 84.45,87.31 85.41,88.27 72.07,92.71 73.03,93.66 73.98,92.71 74.93,93.66 75.88,92.71 76.83,93.66 77.79,92.71 78.74,93.66 79.69,92.71 80.64,93.66 81.6,92.71 82.55,93.66 83.5,92.71 84.45,93.66 85.41,92.71 81.6,94.61 77.79,94.61 73.98,94.61 75.88,94.61 79.69,94.61 83.5,94.61 95.57,11.43 89.53,4.76 98.42,18.73 98.42,23.81 98.42,28.89 98.42,34.29 95.57,36.51 94.93,27.94
  pour Top (isolate 0.406, no thermals): 71.44,95.89 86.04,95.89 86.04,87 71.44,87
  pour Bottom (isolate 0.305): 23.5,0.64 29.84,0.64 33.97,4.76 33.97,6.99 31.11,9.84 31.11,22.23 38.1,29.21 43.02,29.21 44.45,27.78 65.09,27.78 69.06,31.75 81.28,31.75 83.19,29.84 83.19,26.04 82.55,25.4 82.55,1.27 83.19,0.64 88.27,0.64 90.17,2.54 90.17,5.71 95.25,10.79 96.52,10.79 99.06,13.34 99.06,59.05 93.98,64.14 69.22,64.14 64.77,59.69 47.62,59.69 41.91,53.98 41.91,47.62 35.56,41.27 30.48,41.27 20.32,31.11 20.32,3.81
  pour Bottom (isolate 0.305, no thermals): 26.04,74.93 26.04,48.9 27.94,46.99 33.02,46.99 37.47,51.44 37.47,53.5 58.42,74.45 66.36,74.61 71.75,80.01 71.75,86.36 72.39,87 85.72,87 87,88.27 87,97.79 85.09,99.69 31.11,99.69 28.57,97.16 28.57,77.47
  pour Top (rank 2): 82.55,1.27 83.19,0.64 88.27,0.64 90.17,2.54 90.17,5.71 95.25,10.79 96.52,10.79 99.06,13.34 99.06,34.92 96.52,37.47 87.95,37.47 83.19,32.7 83.19,26.04 82.55,25.4
GNDIO  (via drill 0.4)
  Top 0.305: IC4.4 v66.67,14.29 | v67.63,14.29 67.94,13.97 IC4.3 | v66.04,5.71 66.04,6.03 66.67,6.67 IC4.5 | C25.2 63.92,11.64 v64.14,11.43 | C26.2 60.22,11.64 v60.01,11.43
  other vias: 46.35,1.27 51.44,1.27 56.52,1.27 61.59,1.27 41.91,5.71 41.91,10.79 37.47,14.61 72.39,1.27 67.31,22.54 62.71,16.83 59.85,16.83
  pour Bottom (isolate 0.305): 34.29,19.68 34.29,17.14 41.27,10.16 41.27,5.08 45.72,0.64 74.3,0.64 75.56,1.91 75.56,21.59 78.11,24.13 78.11,26.04 77.47,26.83 69.69,26.83 65.72,22.86 44.45,22.86 41.91,25.4 40.01,25.4
  pour Top (isolate 0.305): 34.29,17.14 34.29,19.68 40.01,25.4 41.91,25.4 44.45,22.86 65.72,22.86 69.69,26.83 77.47,26.83 78.11,26.04 78.11,24.13 75.56,21.59 75.56,1.91 74.3,0.64 45.72,0.64 41.27,5.08 41.27,10.16
I_U
  Top 0.305: R40.1 97.37,57.57 93.66,61.28 85.31,61.28 C10.1 | R13.2 83.82,71.75 81.28,69.22 81.28,65.3 C10.1 | D2.1 84.45,62.13 C10.1
I_U_OUT
  Top 0.305: C32.1 R43.2 69.22,4.98 IC4.7 69.22,8.57 68.9,8.89 65.41,8.89 63.18,6.67 56.2,6.67 SV1.10
I_V
  Top 0.305: R33.1 92.71,23.81 96.52,27.62 96.52,56.83 94.3,59.05 81.74,59.05 D1.1 80.64,62.13 C9.1 80.64,62.33 80.64,63.5 80.01,64.14 R12.2
I_V_OUT
  Top 0.305: C27.1 R38.2 70.48,14.71 IC4.1 70.48,11.43 69.85,10.79 65.72,10.79 65.41,11.11 65.41,11.75 64.14,13.02 56.2,13.02 SV1.9
I_W
  Top 0.305: R11.2 75.88,64.45 76.83,63.5 76.83,62.33 C8.1 76.83,62.13 D7.1
INUH
  Top 0.305: C21.1 IC1.9 69.22,52.7 71.12,50.8 71.12,41.91 68.4,39.19 IC6.8
INUL
  Top 0.305: IC1.3 81.66,48.09 C22.1 81.28,45.94 81.28,44.45 79.85,43.02 76.68,43.02 70.01,36.35 63.34,36.35 62.39,35.4 61.44,35.4 60.17,34.13 IC6.6
INVH
  Top 0.305: C3.1 IC1.13 60.33,45.4 60.64,45.09 60.64,41.75 58.74,39.85 IC6.10
INVL
  Top 0.305: IC1.4 79.88,47.33 C4.1 78.74,45.94 78.74,44.77 78.11,44.13 76.36,44.13 69.53,37.31 63.18,37.31 62.07,36.2 61.12,36.2 59.85,34.92 57.94,34.92 57.47,34.45 IC6.4
INWH
  Top 0.305: C5.1 IC1.17 51.44,51.44 50.8,50.8 50.8,41.43 51.44,40.8 55.4,40.8 56.2,40.01 IC6.12
INWL
  Top 0.305: IC1.5 78.11,47.84 C18.1 | C18.1 77.05,47.2 | C18.1 77.37,47.31 76.2,47.31 74.3,45.4 74.3,43.66 69.06,38.42 63.18,38.42 61.75,36.99 60.64,36.99 59.21,35.56 55.88,35.56 54.93,34.61 IC6.2
N$1  (1 unrouted)
  Top 0.305: R11.1 75.88,81.91 IC1.23
  Top 3: R6.1 73.66,84.14 75.88,81.92
  Bottom 3: IC1.23 75.76,82.04 73.66,84.14 R6.1
N$2
  Top 0.305: R2.1 53.66,17.04 57.15,20.54 OK1.1 57.15,21.59 58.1,22.54 60.88,22.54 OK1.3
N$3
  pour Top (isolate 0.305, no thermals): 4.76,68.26 0.64,64.14 0.64,59.05 2.54,57.15 11.75,57.15 16.19,61.28 21.27,61.28 29.21,69.22 33.66,69.22 36.83,72.39 36.83,80.01 35.56,81.28 30.48,81.28 18.41,69.22 11.43,69.22 10.48,68.26
N$5  (via drill 0.6)
  Top 0.813: v0.95,67.63 0.95,81.92 X1.2
  Bottom 0.813: 6.39,32.35 U$1.AC1 6.35,32.45 6.29,32.45 3.17,35.56 3.17,55.72 0.95,57.94 v0.95,67.63 | 4.76,85.72 X1.2
  pour Bottom (isolate 0.61, no thermals): 1.59,87.63 1.59,84.77 2.54,83.82 11.11,83.82 12.06,84.77 15.24,84.77 19.68,89.22 19.68,93.34 16.83,96.2 13.65,96.2 10.48,93.03 7.3,89.53 3.49,89.53
N$6
  Top 0.61: IC1.26 53.15,69.24 R16.2
  Top 3.5: IC1.26 53.15,90.66 X2.1
N$7
  Top 0.61: IC1.25 60.77,70.45 R17.2
  Top 3.5: IC1.25 64.14,85.41 64.14,95.89 X2.2
N$8
  Top 0.61: IC1.24 68.39,72.67 R18.2
  Top 3.5: IC1.24 68.39,82.68 68.9,83.19 68.9,96.21 X2.3
N$9
  Top 0.305: R39.2 85.35,3.44 IC5.1
N$10
  Top 0.406: 63.28,9.84 C25.1
  Top 0.61: IC4.8 70.48,9.21 69.85,9.84 63.28,9.84
  Top 0.813: C25.1 63.18,8.99 R37.1
N$11
  Top 0.305: R12.1 IC1.22
  Top 3: IC1.22 80.01,83.56 R8.1
  Bottom 3: IC1.22 80.01,83.56 R8.1
N$12
  Top 0.305: R13.1 83.82,81.85 IC1.21
  Top 3: IC1.21 84.01,84.64 R10.1
  Bottom 3: IC1.21 84.01,84.64 R10.1
N$13
  Top 0.305: IC1.7 74.55,51.27 C7.2
N$14  (via drill 0.4)
  Top 0.305: D2.3 D1.3 D7.3 75.08,57.95 74.3,58.74 v73.82,58.74 | v72.39,57.31 R14.1
  Bottom 0.305: v73.82,58.74 v72.39,57.31
N$15
  Top 0.305: IC1.8 72.77,52.67 C11.1 R15.1 R14.2
N$16
  Top 0.61: IC1.11 64.91,47.62 C13.1 65.72,46.8 65.72,46.35 63.1,43.73 D4.C
N$17
  Top 0.61: C13.2 62.73,49.92 IC1.12 62.87,64.3 R18.1
N$18
  Top 0.61: R19.2 67.94,43.58 D4.A
N$19
  Top 0.61: IC1.15 56.02,47.62 C15.1 56.65,46.17 54.29,43.81 53.57,43.81 D5.C
N$20
  Top 0.61: C15.2 53.97,47.11 IC1.16 53.98,60.33 58.74,65.09 58.74,65.57 R17.1
N$21
  Top 0.61: D5.A 58.19,44.22 59.05,45.09 R20.2
N$22
  Top 0.61: IC1.19 47.13,47.62 C17.1 47.18,46.5 45.09,44.41 45.04,44.41 44.45,43.81 43.51,43.81 43.29,43.59 | 43.73,43.81 43.29,43.59 | 43.29,43.59 D6.C
N$23
  Top 0.61: IC1.20 45.09,57.78 52.7,65.41 53.17,65.41 R16.1 | 44.95,49.92 IC1.20 | C17.2 44,48.97 IC1.20
N$24
  Top 0.61: D6.A 48.34,43.9
  Top 0.813: R21.2 46.51,41.98 D6.A
N$25
  Top 0.305: R29.2 OK4.2
N$26
  Top 0.305: Q1.C 74.4,38.42 R29.1
N$27
  Top 0.305: Q1.B R30.1
N$28
  Top 0.305: IC3.2 R33.2 R34.2 90.7,21.27 90.17,21.27 88.27,19.37 C23.2 87.84,19.05 IC2.3
N$29
  Top 0.305: R3.1 OK2.1 45.09,21.43 46.2,22.54 48.81,22.54 OK2.3
N$31
  Top 0.305: IC4.2 69.22,14.71 R38.1 C27.2 70.91,19.05 IC2.6
N$32
  Top 0.305: R23.1 39.38,14.92 OK3.1 35.56,20.32 37.57,22.33 OK3.3
N$33  (via drill 0.4)
  Top 0.305: v58.9,36.51 60.01,37.62 IC6.9 | C39.1 63.44,32.23 63.44,31.49 63.5,31.43 v63.5,31.27
  Bottom 0.254: v63.5,31.27 59.69,31.27
  Bottom 0.305: OK1.7 59.69,31.27 58.9,32.07 v58.9,36.51 | C39.1 63.5,32.54 v63.5,31.27
N$34
  Top 0.305: IC5.3 87.42,7.62 C29.2 91.44,11.64 IC3.6 91.44,15.24 92.08,15.88 94.93,15.88 95.67,16.61 R40.2 95.67,20.95 R41.2 95.25,21.59
  Top 0.406: C29.2 91.44,11.43
N$35  (1 unrouted)
  Top 0.305: IC3.7 92.71,11.64 C29.1 86.58,5.08
N$36
  Top 0.305: IC3.1 93.98,17.78 93.03,16.83 88.37,16.83 C23.1 88,16.67 R31.1
N$37
  Top 0.305: IC5.6 73.66,7.62 70.48,4.45 70.48,1.91 70.17,1.59 68.26,1.59 67.94,1.91 67.94,2.33 C32.2 R43.1 67.94,4.98 IC4.6
N$38
  Top 0.305: R31.2 IC2.1
N$39  (1 unrouted)
  Top 0.305: IC6.5 58.74,32.07 59.37,31.43 62.23,31.43 | R26.1 63.34,34.61 62.71,33.97 62.71,32.38 62.23,31.91 62.23,31.43 | OK1.6 62.23,31.43
N$40  (via drill 0.4)  (1 unrouted)
  Top 0.305: IC6.11 57.47,37.62 56.83,36.99 55.72,36.99 54.29,35.56 52.07,35.56 51.28,34.77 v48.9,34.77 | v48.9,32.38 48.63,32.07 R4.1 47.62,31.65 OK2.7
  Bottom 0.305: v48.9,34.77 v48.9,32.38
N$41  (1 unrouted)
  Top 0.305: OK2.6 50.16,30.8 50.64,31.27 50.8,31.27 | 50.8,31.27 55.72,31.27 56.2,31.75 IC6.3 | 50.8,31.27 50.64,31.43 50.64,32.23 49.69,33.18 48.1,33.18 47.2,34.08 46.15,34.08 R22.1
N$42  (2 unrouted)
  Top 0.305: IC6.13 54.93,37.78 54.29,37.15 52.7,37.15 51.75,36.2 33.18,36.2 28.57,31.59 28.57,30.22 R24.1 28.57,30.11 28.57,29.21 31.81,25.98 31.97,25.98
N$43  (1 unrouted)
  Top 0.305: 33.86,27.62 OK3.6 33.76,27.83 31.75,29.84 31.75,31.11 33.02,32.38 39.47,32.38 R27.1 39.69,32.7 42.39,35.4 46.99,35.4 48.58,33.81 51.91,33.81 52.86,32.86 53.52,32.86 IC6.1
N$44
  Top 0.305: R1.1 41.44,94.1 LED1.C
N$45
  Top 0.305: R1.2 R44.1
N$46
  Top 0.305: R45.2 LED2.C
N$47
  Top 0.305: R46.2 52.98,3.97 LED3.C
N$48
  Bottom 0.813: U$1.AC2 10,36.04 9.84,36.04 6.67,39.21 6.67,68.74 5.87,69.53
  pour Bottom (isolate 0.61, rank 2, no thermals): 3.17,82.23 1.27,80.33 1.27,70.48 3.17,68.58 6.35,68.58 8.26,70.48 8.26,80.64 6.67,82.23
PWM_U_H
  Top 0.305: SV1.5 49.21,13.12 R2.2
PWM_U_L
  Top 0.305: SV1.6 50.48,9.84 50.48,12.38 54.61,16.51 57.15,16.51 59.69,19.05 | 59.69,19.05 OK1.2 | OK1.4 64.77,19.05 63.98,18.26 60.48,18.26 59.69,19.05
PWM_V_H
  Top 0.305: SV1.3 46.67,15.24 45.09,16.83 R3.2
PWM_V_L
  Top 0.305: OK2.2 47.62,18.26 | 47.62,18.26 47.62,12.7 47.94,12.38 47.94,9.84 SV1.4 | OK2.4 52.7,19.21 51.75,18.26 47.62,18.26
PWM_W_H
  Top 0.305: SV1.1 44.13,14.19 R23.2
PWM_W_L
  Top 0.305: SV1.2 45.4,9.84 45.4,14.92 41.27,19.05 | 41.27,19.05 38.84,19.05 OK3.2 | OK3.4 42.55,22.54 42.55,20.32 41.27,19.05
U_REF
  Top 0.305: R34.1 90.81,22.86 91.44,22.23 94.4,22.23 R41.1 | C24.1 90.59,22.86 R34.1 | R34.1 R35.2 90.59,24.77 R36.1
VCCA  (2 unrouted)
  Top 0.305: 82.97,11.85 82.87,11.75 | IC2.2 83.03,16.51 82.87,16.35 | IC5.2 83.03,5.08 82.87,4.92
  Top 0.406: 95.89,14.19 C20.1 95.61,13.91 IC3.8 93.98,10.79 87.95,4.76 87.95,2.64
  Top 0.61: C19.1 90.59,26.46 R35.1 | R32.2 90.6,26.45
  Top 0.813: R32.2 83.82,26.04 82.87,25.08 82.87,16.35 82.87,11.75 82.87,4.92 82.87,1.59 83.5,0.95 87.63,0.95 87.95,1.27 87.95,2.44
VCCIO
  Top 0.305: 53.02,11.75 53.02,10.16 53.34,9.84 | 53.34,9.84 55.56,9.84 SV1.12 | LED3.A 53.02,9.53 53.34,9.84
  Top 0.61: 53.02,11.75 55.56,14.29 63.82,14.29 69.95,20.42 R28.2 70.91,20.42 73.66,23.18 75.56,23.18 76.83,24.45 OK4.8
  Top 0.813: SV1.12 60.74,8.57 R37.2 60.96,8.68 C26.1
VFO  (via drill 0.4)
  Top 0.305: IC1.6 76.33,50.93 77.15,51.75 78.74,51.75 81.28,54.29 86.04,54.29 v86.68,53.66 | v86.68,51.75 86.68,46.04 81.92,41.27 81.92,37.57 R30.2
  Bottom 0.305: v86.68,53.66 v86.68,51.75

### Text on the board
tPlace: Rev 0.2 / Designed by / Alex Borisevich / 2014